# Altium schematic sheet Half_bridge.SchDoc
size A; SheetNumber: 2; SheetTotal: 2
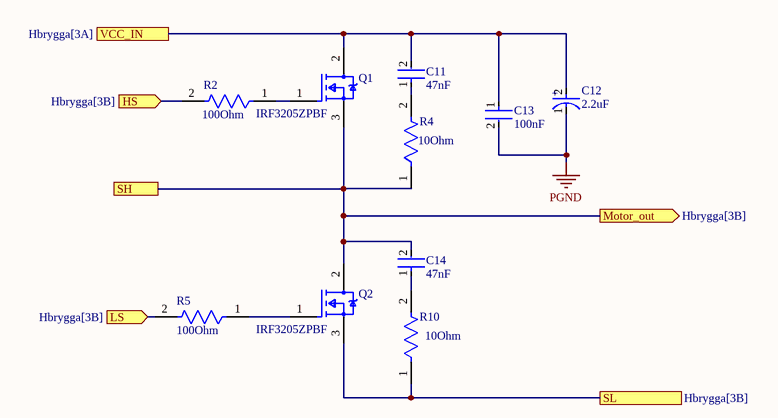
[diagram p0: Half_bridge.SchDoc]

## Parts
C11  47nF  [FP-C1206C-EB-MFG]
C12  2.2uF  [FP-RAD-TH-D_5_0_5-L_11_1-MFG]
C13  100nF  [FP-C1206C-EB-MFG]
C14  47nF  [FP-C1206C-EB-MFG]
Q1  IRF3205ZPBF  [FP-PG-TO220-3-MFG]
Q2  IRF3205ZPBF  [FP-PG-TO220-3-MFG]
R2  100Ohm  [FP-AT1206-IPC_A]
R4  10Ohm  [FP-AT1206-IPC_B]
R5  100Ohm  [FP-AT1206-IPC_A]
R10  10Ohm  [FP-AT1206-IPC_B]

## Ports
HS (in, see Hbrygga[3B]), LS (in, see Hbrygga[3B]), Motor_out (out, see Hbrygga[3B]), SH, SL (see Hbrygga[3B]), VCC_IN (see Hbrygga[3A])

## Nets
PGND: C12.1(C) C13.2
HS: R2.2 ; port HS
LS: R5.2 ; port LS
Motor_out: C14.2 Q1.3(S) Q2.2(D) R4.1 ; port Motor_out, port SH
SL: Q2.3(S) R10.1 ; port SL
VCC_IN: C11.2 C12.2(A) C13.1 Q1.2(D) ; port VCC_IN
NetC11_1: C11.1 R4.2
NetC14_1: C14.1 R10.2
NetQ1_1: Q1.1(G) R2.1
NetQ2_1: Q2.1(G) R5.1

## Notes on the sheet
- (in symbol CMP-05427-000193-1) +

## Library data of the parts
C11 C14 = CMP-03020-010204-1: C1206 47,000 pF X8R 20.00% 50 V; Manufacturer Part Number: C1206C473M5HAC; Manufacturer: KEMET; Voltage Rating: 50 V; Tolerance: 0.2; Material: Ceramic; Temperature Coefficient: 15%; Automotive Grade: Grade 0; Temperature Characteristic: X8R; Capacitance: 47,000 pF; Value: 47,000 pF; Octopart: https://octopart.com/c1206c473m5hac-kemet-98183372; Package: C1206C-EB; Height: 0.88mm; Device Class L2: Capacitors; Temperature: -55°C to +150°C; Ipc Land Pattern Name: CAPC320160X78; Mouser Description: Multilayer Ceramic Capacitors MLCC - SMD/SMT 50volts 47000pF 20% ULTRA STABLE X8R; RoHS: TRUE; Temperature Range Low: -55°C; Lead Free: Yes; Temperature Range High: +150°C; ComponentLink2URL: https://content.kemet.com/datasheets/KEM_C1007_X8R_ULTRA_150C_SMD.pdf; Device Class L1: Passive Components; ComponentLink2Description: Datasheet; Category: Cap; Device Class L3: Ceramic Capacitors; Automotive: Yes
C12 = CMP-05427-000193-1: Aluminum Electrolytic Capacitors (Radial Lead Type) 2.2uF ±20% 100V; Life (Hours): 2000Hour; Leakage Current: 3uA; Voltage: 63V; Dissipation Factor: 0.1%; Lead/Base Style: Straight; Ripple Current: 30mA; Lead Diameter: 0.5mm; Dielectric Material: Aluminium; Packaging: Bulk; Lead Free: Lead Free; Case/Package: Radial; Mount: Through Hole; Diameter: 5mm; Termination: Radial; Radiation Hardening: No; Series: M; Package Quantity: 200; Voltage Rating (DC): 100V; Lead Pitch: 2mm; Tolerance: 20%; Height - Seated (Max): 0.472inch; Min Operating Temperature: -40°C; Max Operating Temperature: 85°C; Number of Pins: 2; RoHS Compliant: Yes; Height: 11mm; Capacitance: 2.2uF; REACH SVHC: No SVHC; Voltage Rating: 100V; Length: 11mm; Contact Plating: Tin; Construction: RADIAL; Ripple Current (AC): 30mA
C13 = CMP-03020-008411-1: C1206 0.10 μF U2J 2.00% 16 V; Manufacturer Part Number: C1206C104G4JACAUTO; Manufacturer: KEMET; Material: Ceramic; Temperature Coefficient: 15%; Tolerance: 0.02; Value: 0.10 μF; Automotive Grade: Grade 0; Voltage Rating: 16 V; Lead Free: Yes; RoHS: TRUE; Device Class L3: Ceramic Capacitors; Height: 0.88mm; ComponentLink2Description: Datasheet; Device Class L1: Passive Components; Package: C1206C-EB; Ipc Land Pattern Name: CAPC320160X78; Automotive: Yes; Category: Cap; Octopart: https://octopart.com/c1206c104g4jacauto-kemet-84732513; Temperature Range High: +150°C; Temperature: -55°C to +150°C; ComponentLink2URL: https://content.kemet.com/datasheets/KEM_C1007_X8R_ULTRA_150C_SMD.pdf; Device Class L2: Capacitors; Temperature Characteristic: U2J; Temperature Range Low: -55°C; Capacitance: 0.10 μF
Q1 Q2 = CMP-32901-000996-1: MOSFET N-CH 55V 75A TO220AB; Power Dissipation: 170W; Polarization: N; Fall Time: 67ns; Input Capacitance: 3.45nF; Threshold Voltage: 4V; Drain to Source Resistance: 6.5mR; Turn-On Delay Time: 18ns; Turn-Off Delay Time: 45ns; Element Configuration: Single; Gate to Source Voltage (Vgs): 20V; Max Dual Supply Voltage: 55V; Max Power Dissipation: 170W; Max Operating Temperature: 175°C; Packaging: Rail/Tube; REACH SVHC: No SVHC; Halogen Free: Not Halogen Free; Height: 0.355inch; Length: 0.42inch; RoHS Compliant: Yes; Min Operating Temperature: -55°C; Lead Free: Lead Free; Width: 0.19inch; Case/Package: TO-220; Mount: Through Hole; Drain to Source Breakdown Voltage: 55V; Continuous Drain Current (ID): 75A; Rds On Max: 6.5mR; Drain to Source Voltage (Vdss): 55V; Series: HEXFET®; Number of Pins: 3
R2 R5 = CMP-03412-041120-1: Thin Film Chip Resistors Automotive Grade 100Ω 0.1% 10ppm/°C 1206
R4 R10 = CMP-03412-042184-1: Thin Film Chip Resistors Automotive Grade 10Ω 0.1% 25ppm/°C 1206; Max Power Dissipation: 250mW; Resistance: 10R; Series: AT; Tolerance: 0.1%; Packaging: Tape and Reel; RoHS Compliant: Yes; Number of Terminations: 2; Length: 0.122inch; Max Operating Temperature: 155°C; Temperature Coefficient: 25ppm/°C; Min Operating Temperature: -55°C; Features: Moisture Resistant; Case/Package: 1206; Height: 0.026inch; Width: 0.063inch; Resistor Type: Thin Film